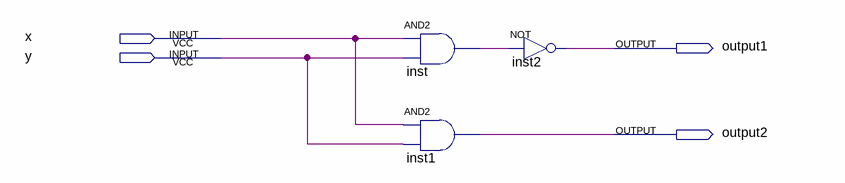
[diagram p0: schematic sheet]
// Quartus schematic GateDemo.bdf as structural Verilog: 3 symbols, 4 pins
module GateDemo (
  input  x,
  input  y,
  output output1,
  output output2
);

  wire inst_out;

  and inst (inst_out, x, y);
  and inst1 (output2, x, y);
  not inst2 (output1, inst_out);
endmodule
